# Altium schematic sheet JBT_schem.SchDoc
size A
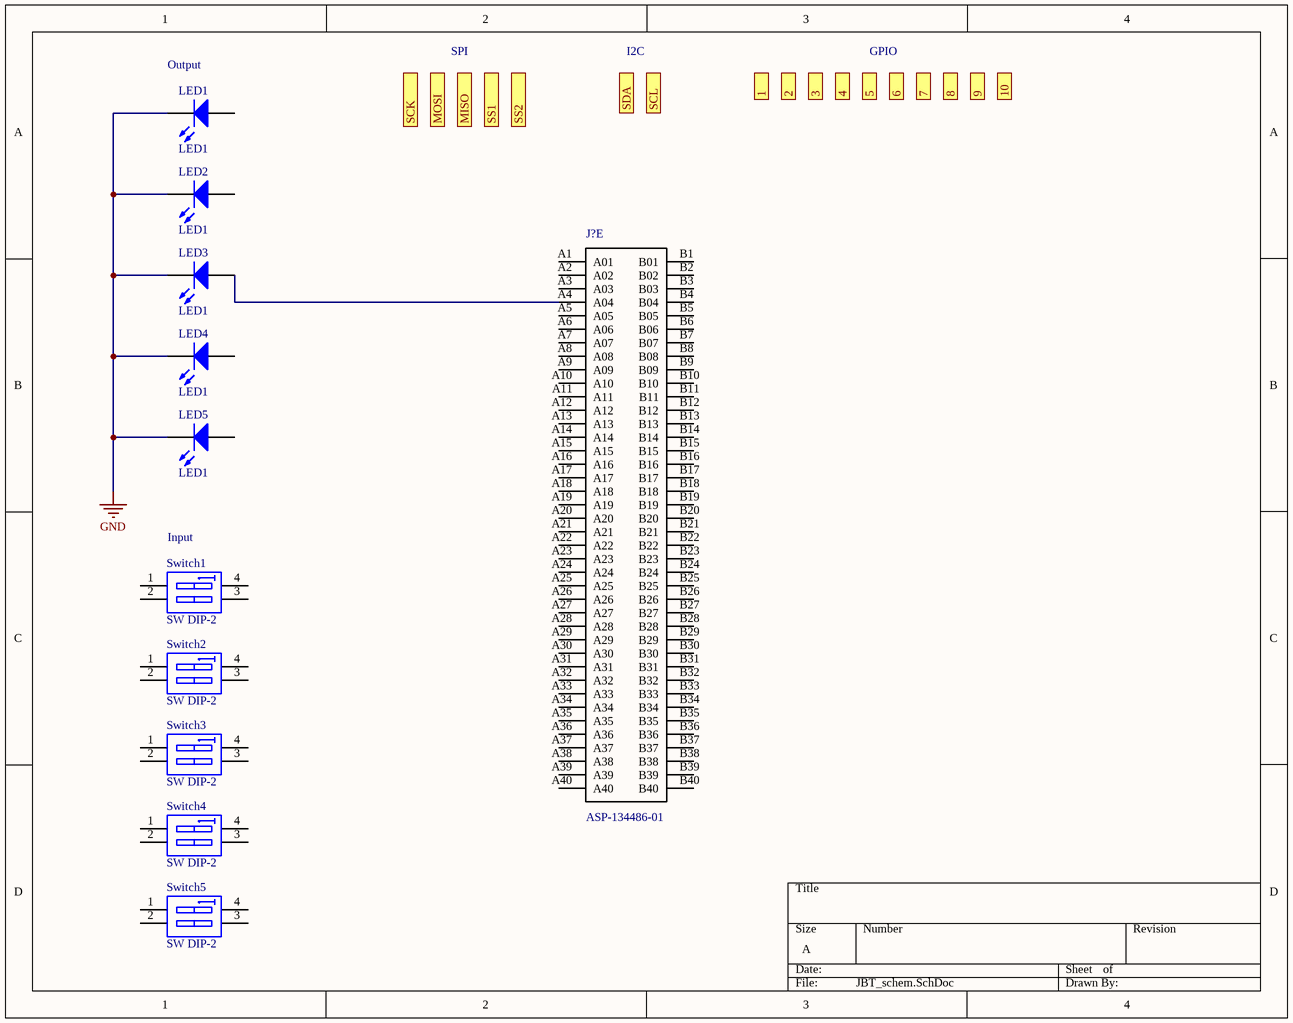
[diagram p0: JBT_schem.SchDoc]

## Parts
J?  ASP-134486-01  [*SAMTEC_ASP-134486-01_ASP-134486-01(Primary)]  (part E of 5)
LED1  LED1  [LED-1]
LED2  LED1  [LED-1]
LED3  LED1  [LED-1]
LED4  LED1  [LED-1]
LED5  LED1  [LED-1]
Switch1  SW DIP-2  [DIP-4]
Switch2  SW DIP-2  [DIP-4]
Switch3  SW DIP-2  [DIP-4]
Switch4  SW DIP-2  [DIP-4]
Switch5  SW DIP-2  [DIP-4]

## Ports
1, 2, 3, 4, 5, 6, 7, 8, 9, 10, MISO, MOSI, SCK, SCL, SDA, SS1, SS2

## Nets
GND: LED1.2(K) LED2.2(K) LED3.2(K) LED4.2(K) LED5.2(K)
NetJ?_A4: J?.A4(A04) LED3.1(A)

Not connected (* = marked no-connect by the designer): J? A1(A01) A2(A02) A3(A03) A5(A05) A6(A06) A7(A07) A8(A08) A9(A09) A10 A11 A12 A13 A14 A15 A16 A17 A18 A19 A20 A21 A22 A23 A24 A25 A26 A27 A28 A29 A30 A31 A32 A33 A34 A35 A36 A37 A38 A39 A40 B1(B01) B2(B02) B3(B03) B4(B04) B5(B05) B6(B06) B7(B07) B8(B08) B9(B09) B10 B11 B12 B13 B14 B15 B16 B17 B18 B19 B20 B21 B22 B23 B24 B25 B26 B27 B28 B29 B30 B31 B32 B33 B34 B35 B36 B37 B38 B39 B40; LED1 1(A); LED2 1(A); LED4 1(A); LED5 1(A); Switch1 1(A1) 2(A2) 3(B2) 4(B1); Switch2 1(A1) 2(A2) 3(B2) 4(B1); Switch3 1(A1) 2(A2) 3(B2) 4(B1); Switch4 1(A1) 2(A2) 3(B2) 4(B1); Switch5 1(A1) 2(A2) 3(B2) 4(B1)

## Notes on the sheet
- (near LED1) Output
- SPI
- I2C
- GPIO
- (near Switch1) Input

## Library data of the parts
J? = ASP-134486-01: 400 Position Connector Array, Female Sockets Surface Mount Gold; MF: Samtec Inc.; MP: ASP-134486-01; Digi-Key_Purchase_URL: https://www.digikey.com/product-detail/en/samtec-inc/ASP-134486-01/SAM8728CT-ND/2135095?utm_source=snapeda&utm_medium=aggregator&utm_campaign=symbol; SnapEDA_Link: https://www.snapeda.com/parts/ASP-134486-01/Samtec%20Inc./view-part/898249/?ref=snap; Package: None; Digi-Key_Part_Number: SAM8728CT-ND; Value: *
LED1-LED5 = LED1: Typical RED GaAs LED; Published: 8-Jun-2000; LatestRevisionDate: 08-Jul-2005; LatestRevisionNote: Mech Layer 1 removed.; PackageReference: LED-1; Publisher: Altium Limited; PackageDescription: LED; 2 Leads
Switch1-Switch5 = SW DIP-2: DIP Switch, 2 Position, SPST; Published: 24-Mar-1999; LatestRevisionDate: 17-Jul-2002; LatestRevisionNote: Re-released for DXP Platform.; PackageReference: DIP-4; Publisher: Altium Limited